# EAGLE design p (EAGLE 7.1.0)
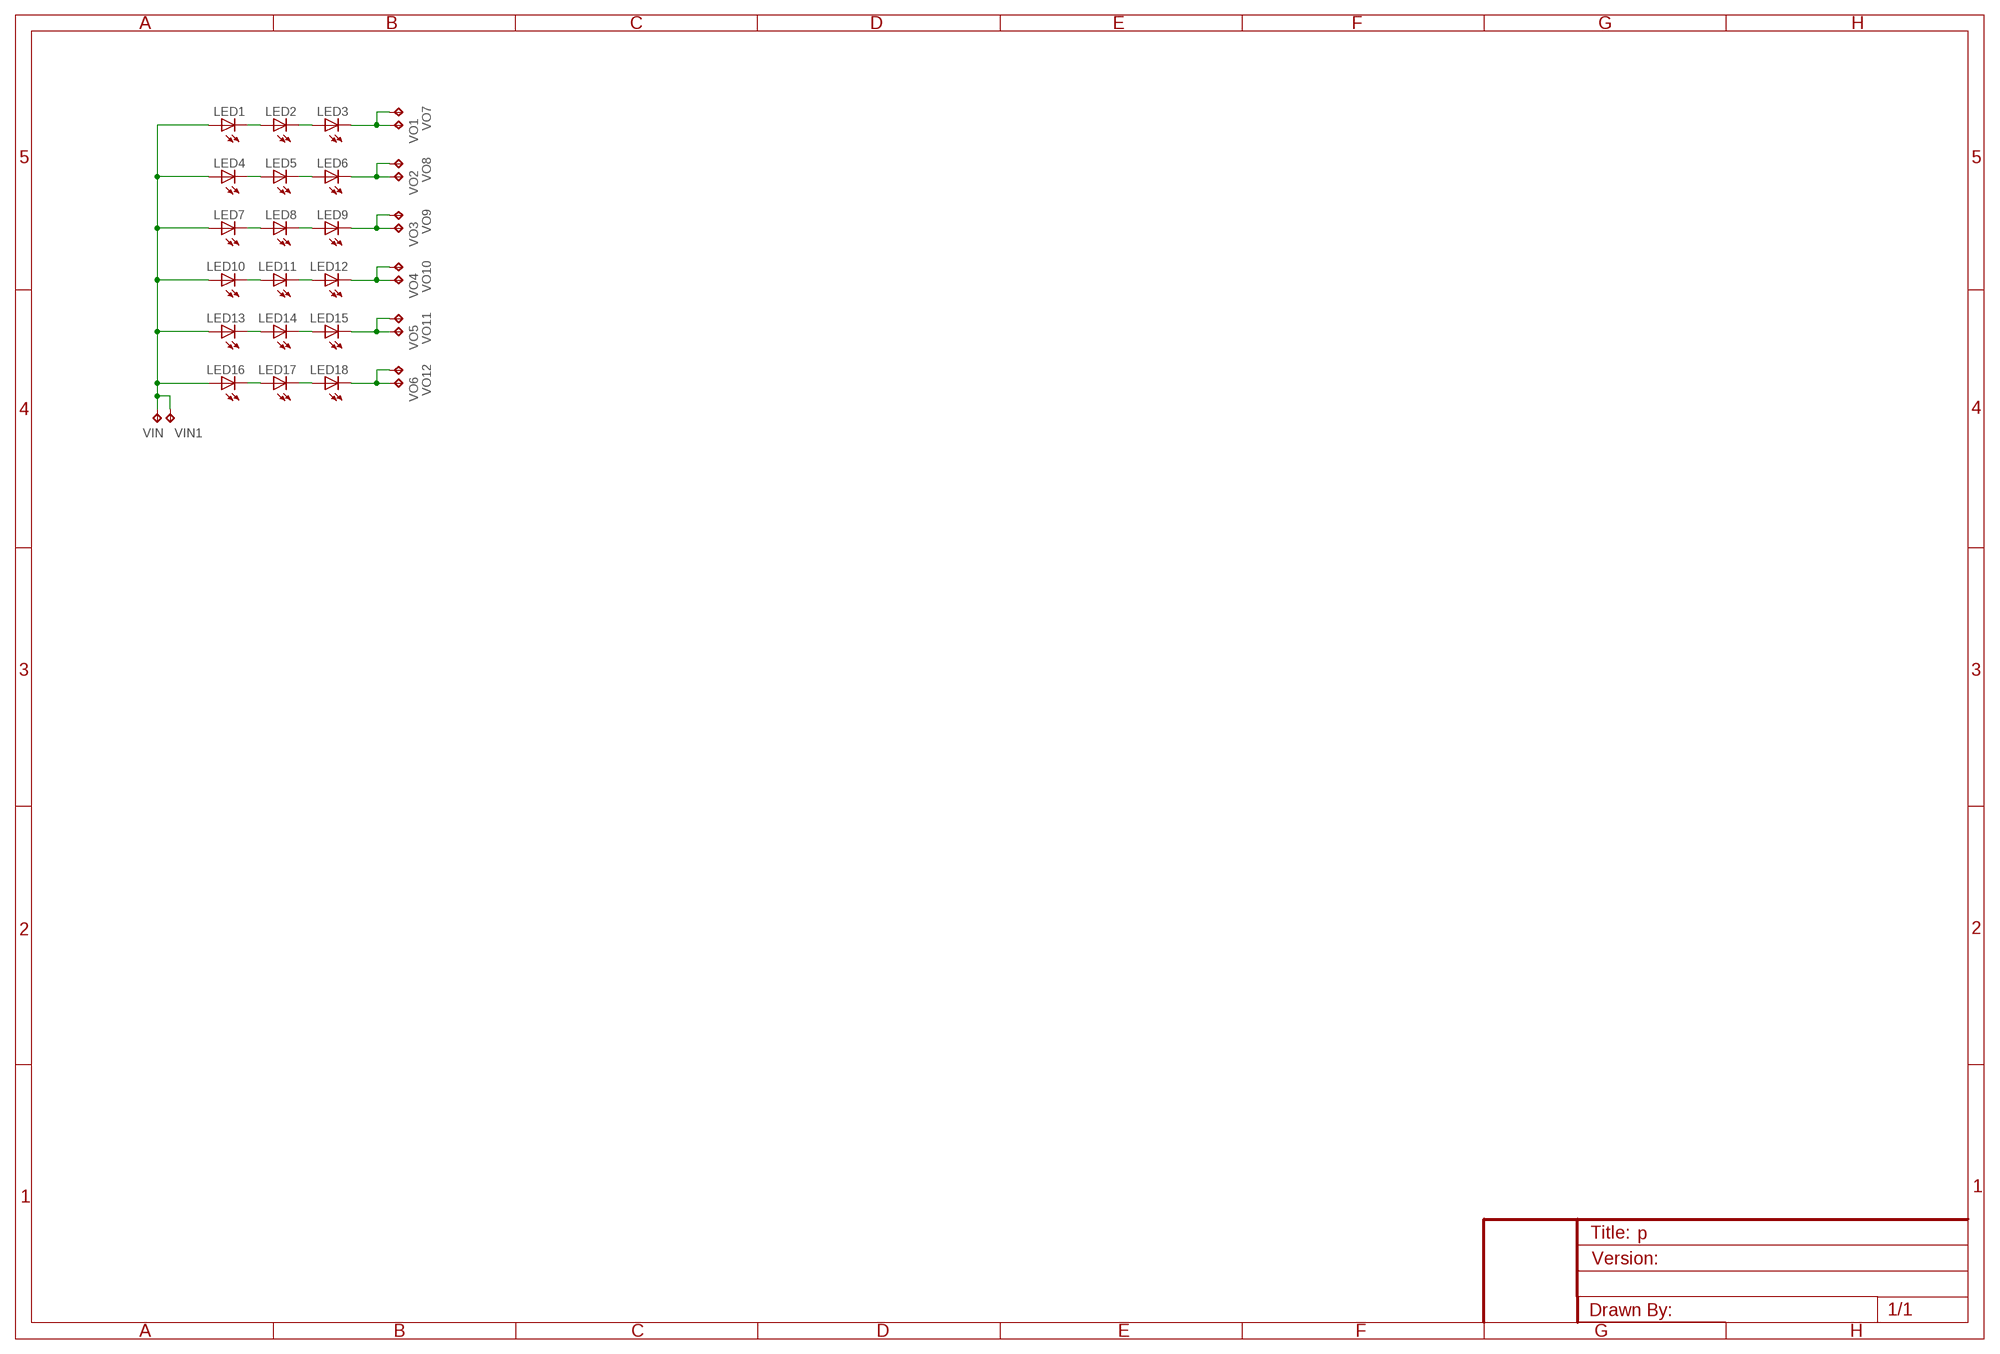
[diagram p0: schematic, sheet 1]

## Parts
LED1  LED0805  [LED_0805]
LED2  LED0805  [LED_0805]
LED3  LED0805  [LED_0805]
LED4  LED0805  [LED_0805]
LED5  LED0805  [LED_0805]
LED6  LED0805  [LED_0805]
LED7  LED0805  [LED_0805]
LED8  LED0805  [LED_0805]
LED9  LED0805  [LED_0805]
LED10  LED0805  [LED_0805]
LED11  LED0805  [LED_0805]
LED12  LED0805  [LED_0805]
LED13  LED0805  [LED_0805]
LED14  LED0805  [LED_0805]
LED15  LED0805  [LED_0805]
LED16  LED0805  [LED_0805]
LED17  LED0805  [LED_0805]
LED18  LED0805  [LED_0805]
VIN  TEST_POINTPAD1-20  [P1-20]
VIN1  TEST_POINTPAD1-20  [P1-20]
VO1  TEST_POINTPAD1-20  [P1-20]
VO2  TEST_POINTPAD1-20  [P1-20]
VO3  TEST_POINTPAD1-20  [P1-20]
VO4  TEST_POINTPAD1-20  [P1-20]
VO5  TEST_POINTPAD1-20  [P1-20]
VO6  TEST_POINTPAD1-20  [P1-20]
VO7  TEST_POINTPAD1-20  [P1-20]
VO8  TEST_POINTPAD1-20  [P1-20]
VO9  TEST_POINTPAD1-20  [P1-20]
VO10  TEST_POINTPAD1-20  [P1-20]
VO11  TEST_POINTPAD1-20  [P1-20]
VO12  TEST_POINTPAD1-20  [P1-20]

## Nets
N$1: LED2.C LED3.A
N$2: LED1.C LED2.A
N$5: LED5.C LED6.A
N$6: LED4.C LED5.A
N$9: LED8.C LED9.A
N$10: LED7.C LED8.A
N$13: LED11.C LED12.A
N$14: LED10.C LED11.A
N$17: LED14.C LED15.A
N$18: LED13.C LED14.A
N$21: LED17.C LED18.A
N$22: LED16.C LED17.A
VIN: LED1.A LED4.A LED7.A LED10.A LED13.A LED16.A VIN1.TP VIN.TP
VOUT1: LED3.C VO1.TP VO7.TP
VOUT2: LED6.C VO2.TP VO8.TP
VOUT3: LED9.C VO3.TP VO9.TP
VOUT4: LED12.C VO4.TP VO10.TP
VOUT5: LED15.C VO5.TP VO11.TP
VOUT6: LED18.C VO6.TP VO12.TP

## Library data of the parts
LED1-LED18 = CyberRailGuru:LED: LEDs Standard schematic elements and footprints for 5mm, 3mm, 1206, and 0603 sized LEDs. 5mm - Spark Fun Electronics SKU : COM-00529 (and others)
VIN VIN1 VO1-VO12 = CyberRailGuru:TEST_POINT: Test pad

## Board
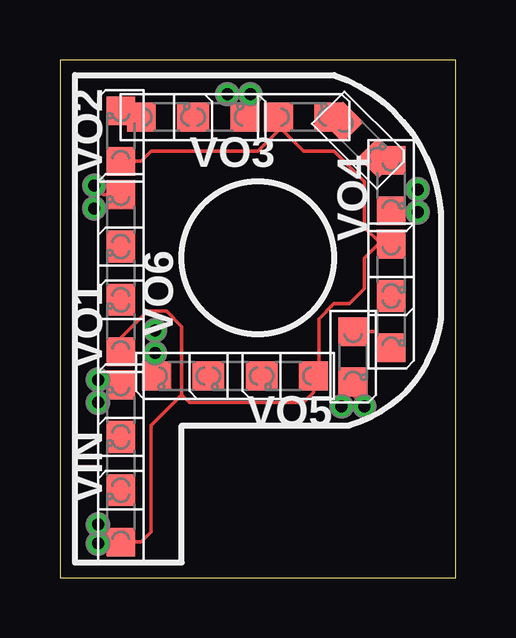
[diagram p1: board, top side]

Size 16.51 x 21.59 mm. Coordinates in mm from the lower left corner, seen from the top.
Outline: 0,0 16.51,0 16.51,21.59 0,21.59 0,0
Copper layers (1*16): Top 0.035mm / dielectric 1.5mm / Bottom 0.035mm
Design rules "Fusion_eagle_rule_v1.1_tms *": minimum track width 6mil, minimum drill 12mil, track to track 6mil, track to pad 6mil, pad to pad 6mil, via to via 6mil, smd to smd 0mil, copper to edge 10mil, drill to drill 10mil, minimum pad ring 10mil, minimum via ring 6mil, stop-mask expansion 2mil, vias tented up to drill 100mil, thermal gap 10mil

### Footprints (pad centres in the part's own frame; a part is rotated, then mirrored left to right if it is on the bottom)
LED_0805 = smd 1.2 x 1.2: A 0,-1.05; C 0,1.05
P1-20 = drill 0.5: TP 0,0

### Placement (x,y rotation side)
LED1  2.54,2.54 0 top
LED2  2.54,4.76 0 top
LED3  2.54,6.99 0 top
LED4  2.54,10.48 0 top
LED5  2.54,12.7 0 top
LED6  2.54,14.92 0 top
LED7  2.54,18.41 0 top
LED8  4.45,19.21 270 top
LED9  6.67,19.21 270 top
LED10  10.16,19.21 270 top
LED11  12.54,18.26 225 top
LED12  13.81,16.35 180 top
LED13  13.81,12.86 180 top
LED14  13.81,10.64 180 top
LED15  12.22,9.21 180 top
LED16  9.53,8.41 90 top
LED17  7.3,8.41 90 top
LED18  5.08,8.41 90 top
VIN  1.59,1.43 180 top
VIN1  1.59,2.22 0 top
VO1  1.59,7.3 180 top
VO2  1.43,15.4 180 top
VO3  6.99,20.16 180 top
VO4  14.92,15.24 180 top
VO5  12.7,7.14 180 top
VO6  3.97,9.37 180 top
VO7  1.59,8.26 0 top
VO8  1.43,16.35 0 top
VO9  7.94,20.16 0 top
VO10  14.92,16.19 0 top
VO11  11.75,7.14 0 top
VO12  3.97,10.32 0 top

### Tracks (layer width: path | path; a pad name or v marks a point on that pad's centre or on a via)
N$1
  Top 0.152: LED2.C LED3.A
N$2
  Top 0.152: LED1.C LED2.A
N$5
  Top 0.152: LED5.C LED6.A
N$6
  Top 0.152: LED4.C LED5.A
N$9
  Top 0.152: LED8.C LED9.A
N$10
  Top 0.152: LED7.C 3.14,19.46 LED8.A
N$13
  Top 0.152: LED11.C 13.7,17.51 LED12.A
N$14
  Top 0.152: LED10.C 11.59,19.21 LED11.A
N$17
  Top 0.152: LED15.A 13.14,10.26 LED14.C
N$18
  Top 0.152: LED14.A LED13.C
N$21
  Top 0.152: LED17.C LED18.A
N$22
  Top 0.152: LED16.C LED17.A
VIN
  Top 0.152: LED7.A 3.4,17.36 3.81,17.78 8.26,17.78 9.11,18.64 LED10.A 9.11,18.83 10.16,17.78 11.43,17.78 12.7,16.51 12.7,14.61 13.34,13.97 13.75,13.97 LED13.A 13.27,13.91 12.7,13.34 12.7,12.06 12.06,11.43 11.43,11.43 10.79,10.79 10.79,8.63 LED16.A 10.57,7.72 10.16,7.3 5.4,7.3 5.08,7.62 | 5.08,7.62 3.81,6.35 3.81,1.91 3.4,1.49 LED1.A 2.48,1.43 VIN.TP VIN1.TP | 5.08,7.62 5.08,10.48 4.45,11.11 3.65,11.11 2.54,10 LED4.A 2.54,9.53
VOUT1
  Top 0.152: LED3.C 1.81,8.04 VO7.TP VO1.TP
VOUT2
  Top 0.152: LED6.C 1.81,15.97 VO8.TP VO2.TP
VOUT3
  Top 0.152: LED9.C 7.72,19.94 VO9.TP VO3.TP
VOUT4
  Top 0.152: LED12.C 14.86,15.3 VO4.TP VO10.TP
VOUT5
  Top 0.152: LED15.C 12.22,7.62 VO5.TP VO11.TP
VOUT6
  Top 0.152: LED18.C 4.03,9.3 VO6.TP VO12.TP

### Text on the board
201bmp: P